# Altium schematic sheet Sheet1.SchDoc
size A4; SheetNumber: 1; SheetTotal: 1
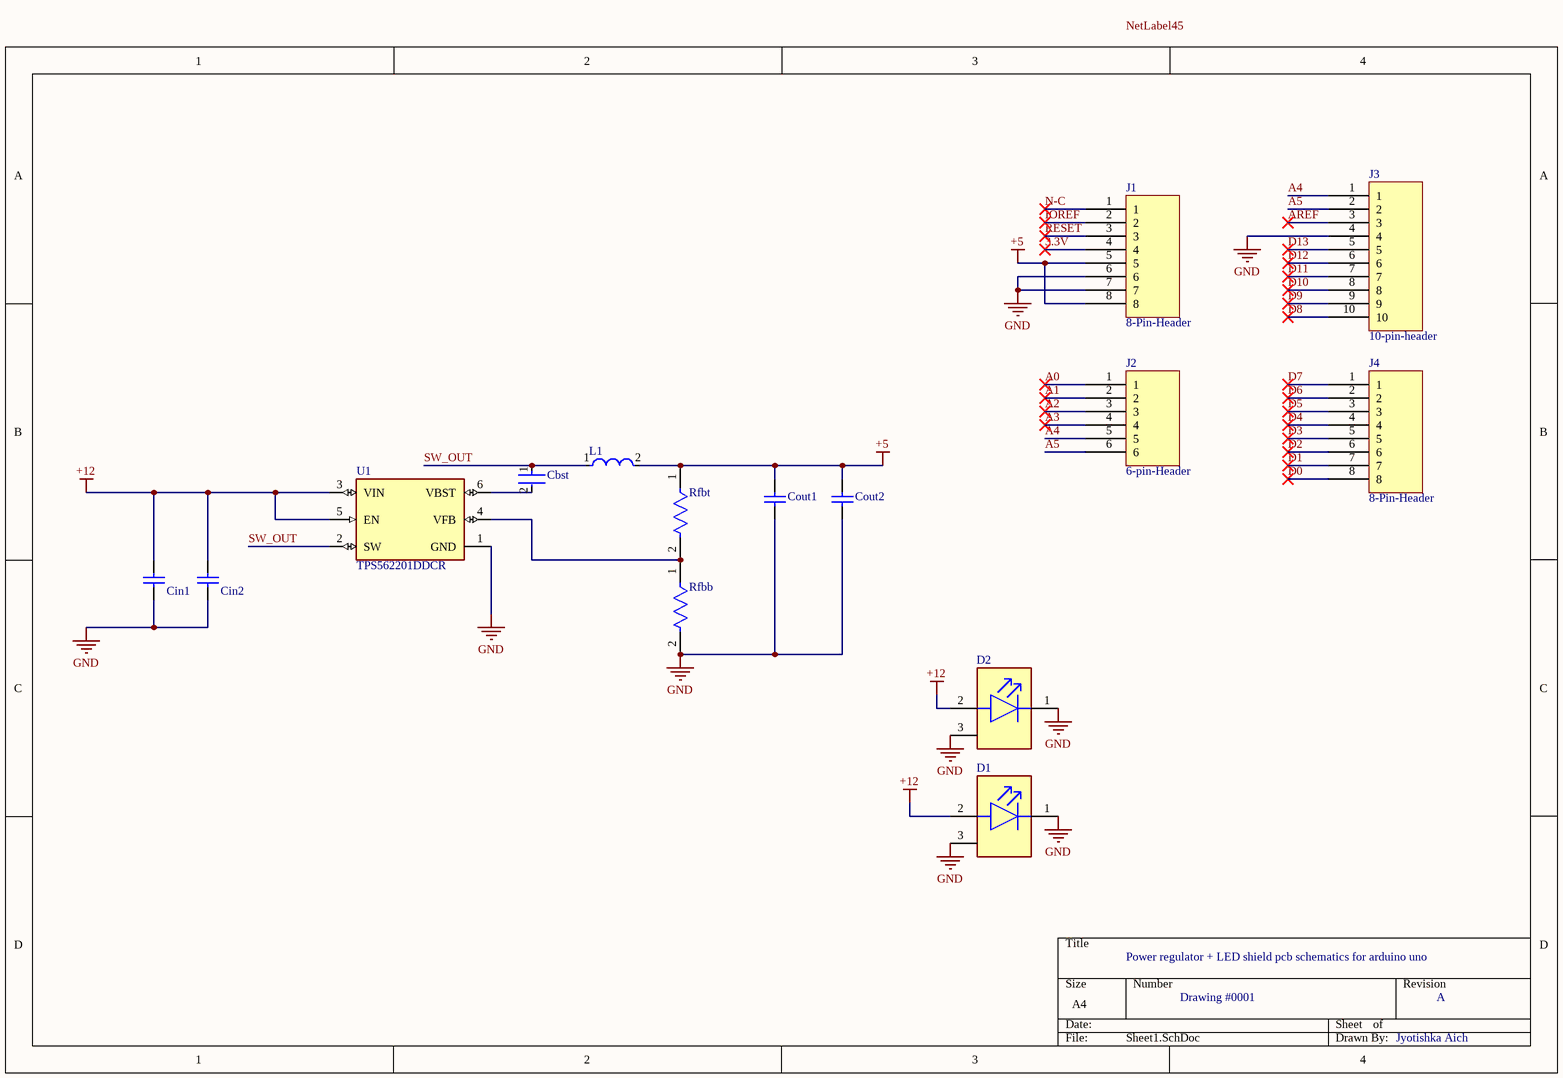
[diagram p0: Sheet1.SchDoc]

## Parts
Cbst  CC0805KRX7R8BB104  [FP-CC0805-0_85-MFG]  (value not drawn)
Cin1  GRM31CR61E106KA12L  [CAPC3216X180X55ML20T25]  (value not drawn)
Cin2  GRM31CR61E106KA12L  [CAPC3216X180X55ML20T25]  (value not drawn)
Cout1  C1608X5R1A226M080AC  [CAPC1608X100X20ML10]  (value not drawn)
Cout2  C1608X5R1A226M080AC  [CAPC1608X100X20ML10]  (value not drawn)
D1  LXR7-SW30  [FP-LXR7-SW30-MFG]  (value not drawn)
D2  LXR7-SW30  [FP-LXR7-SW30-MFG]  (value not drawn)
J1  8-Pin-Header  [8-Pin-Header-Footprint-1]
J2  6-pin-Header  [6-pin-Header-Footprint]
J3  10-pin-header  [10-pin-header-Footprint-1]
J4  8-Pin-Header  [8-Pin-Header-Footprint-1]
L1  NRS8030T3R3MJGJ  [FP-NRS8030-MFG]  (value not drawn)
Rfbb  CRCW040210K0FKED  [FP-CRCW0402-e3-IPC_B]  (value not drawn)
Rfbt  AC0402FR-0756K2L  [FP-AC0402-IPC_B]  (value not drawn)
U1  TPS562201DDCR  [FP-DDC0006A-IPC_C]

## Nets
+5: Cout1.1 Cout2.1 J1.5 J1.8 L1.2 Rfbt.1
+12: Cin1.1 Cin2.1 D1.2(A) D2.2(A) U1.3(VIN) U1.5(EN)
GND: Cin1.2 Cin2.2 Cout1.2 Cout2.2 D1.1(C) D1.3(THERMAL_PAD) D2.1(C) D2.3(THERMAL_PAD) J1.6 J1.7 J3.4 Rfbb.2 U1.1(GND)
3.3V: J1.4
A0: J2.1
A1: J2.2
A2: J2.3
A3: J2.4
A4: J2.5 J3.1
A5: J2.6 J3.2
AREF: J3.3
D0: J4.8
D1: J4.7
D2: J4.6
D3: J4.5
D4: J4.4
D5: J4.3
D6: J4.2
D7: J4.1
D8: J3.10
D9: J3.9
D10: J3.8
D11: J3.7
D12: J3.6
D13: J3.5
IOREF: J1.2
N-C: J1.1
RESET: J1.3
SW_OUT: Cbst.1 L1.1 U1.2(SW)
NetCbst_2: Cbst.2 U1.6(VBST)
NetRfbb_1: Rfbb.1 Rfbt.2 U1.4(VFB)

## Notes on the sheet
- Power regulator + LED shield pcb schematics for arduino uno
- Drawing #0001
- A
- Jyotishka Aich
- Labels drawn without touching a wire or pin: NetLabel45

## Library data of the parts
Cbst = CMP-1036-04410-2: CAP CER 0.1UF 25V X7R 0805; Manufacturer: Yageo; Tolerance: 0.1; Value: 100 nF; ComponentLink2URL: http://www.yageo.com/documents/recent/UPY-GPHC_Y5V_6.3V-to-50V_8.pdf; Category: Cap; Mouser Description: Multilayer Ceramic Capacitors MLCC - SMD/SMT 100nF 25V X7R 10%; Manufacturer Part Number: CC0805KRX7R8BB104; Device Class L1: Passive Components; Footprint Url: http://www.yageo.com/exep/pages/download/literatures/UPY-C_GEN_24.pdf; Height: 0.95mm; Material: Ceramic; Digikey Description: CAP CER 0.1UF 25V X7R 0805; Lead Free: Yes; Temperature Range High: +85°C; Temperature: -30°C to +85°C; Ipc Land Pattern Name: CAPC200125X85; Capacitance: 100 nF; Automotive: No; Octopart: https://octopart.com/cc0805krx7r8bb104-yageo-39467766; Device Class L2: Capacitors; Temperature Characteristic: X7R; Voltage Rating: 25 V; ComponentLink2Description: Datasheet; Temperature Range Low: -30°C; Device Class L3: Ceramic Capacitors; RoHS: TRUE; Package: CC0805-0.85
Cin1 Cin2 = CMP-2000-04947-1: Chip Capacitor, 10 uF, +/- 10%, 25 V, -55 to 85 degC, 1206 (3216 Metric), RoHS, Tape and Reel; Manufacturer: Murata; Case Height: 1.6mm; Voltage Rating DC: 25V; Capacitance: 10uF; Dielectric: X5R; Case Length: 3.2mm; Brand: MurataElectronics; Maximum Operating Temperature: +85C; Datasheet URL: https://datasheet.ciiva.com/11786/0900766b80ef921d-11786983.pdf; Tolerance: 10%; Case Code - mm: 3216; Datasheet Version: Sep-13; Packaging: Reel; Product Category: MultilayerCeramicCapacitorsMLCC-SMD/SMT; Manufacturer URL: http://www.murata.com/; Factory Pack Quantity: 2000; Type: GeneralPurposeMLCC; Minimum Operating Temperature: -55C; Product: GeneralTypeMLCCs; Package Reference: 1206; RoHS: Details; Package / Case: 1206(3216metric); Package Description: 2-Pin Surface Mount Device, Body 3.2 x 1.6 mm; Case Code - in: 1206; Termination Style: SMD/SMT; Series: GRM; Case Width: 1.6mm
Cout1 Cout2 = CMP-2000-05441-1: Chip Capacitor, 22 uF, +/- 20%, 10 V, -55 to 85 degC, 0603 (1608 Metric), RoHS, Tape and Reel; Manufacturer: TDK; PCN Part Number: MLCCPartNumberChange30/Nov/2012; Voltage - Rated: 10V; Product Training Modules: CSeriesGeneralApplicationsSEAT,CCV,andTVCLDesignToolsGuidetoReplacinganElectrolyticCapacitorwithanMLCC; Other Names: 445-9077-1; Design Resources: 20WNon-IsolatedBuckLEDDriverUsingPLLNK460KG; Online Catalog: CSeries,GeneralPurpose; Capacitance: 22µF; Temperature Coefficient: X5R; Kits: 445-9014-KIT-ND-KITMLCC100PF-22UF060310-50V; Packaging: CutTape(CT); Standard Package: 1; Package / Case: 0603(1608Metric); Lead Style: -; Features: -; Ratings: -; Operating Temperature: -55degC~85degC; Applications: GeneralPurpose; Package Reference: 603; Datasheet URL: http://download.siliconexpert.com/pdfs/2015/4/21/15/54/45/779/tdk_/manual/37024850441143360mlcc_commercial_general_en.pdf; Datasheet Version: Mar-15; Mounting Type: SurfaceMount,MLCC; Lead Spacing: -; Size / Dimension: 0.063"Lx0.031"W(1.60mmx0.80mm); Height - Seated (Max): -; Package Description: 2-Pin Surface Mount Device, Body 1.6 x 0.8 mm; Manufacturer URL: http://www.tdk.com/; RoHS Information: RoHSCertificate-MLCC; Tolerance: ±20%; Series: C; Thickness (Max): 0.035"(0.90mm); Family: CeramicCapacitors; Category: Capacitors
D1 D2 = CMP-2100-00228-2: LED LUXEON WARM WHITE 3000K 2SMD; Manufacturer: Philips Lumileds; Luminous Flux: 1000lm; Led Orientation: Top View; Max Junction Temp: +135°C; Forward Current: 1200mA; Forward Voltage: 11.2V; Viewing Angle: 120°; RoHS: TRUE; Octopart: https://octopart.com/lxr7-sw30-philips+lumileds-23267781; Colour: White; Temperature: -40°C to +135°C; Lead Free: Yes; Package: LXR7-SW30; Automotive: No; Digikey Description: LED LUXEON WARM WHITE 3000K 2SMD; Category: Diode; Manufacturer Part Number: LXR7-SW30; ComponentLink2URL: https://www.lumileds.com/uploads/354/DS103-pdf; Device Class L3: unset; Height: 3.87mm; Mouser Description: High Power LEDs - White Warm White, 3000K 840lm, 700mA, 70CRI; Device Class L1: Optoelectronics; Device Class L2: LEDs; ComponentLink2Description: Datasheet; Temperature Range Low: -40°C; Temperature Range High: +135°C
J1 J4 = CMP-002-00072-5
J2 = CMP-002-00071-7
J3 = CMP-002-00073-5
L1 = CMP-14484-000405-1: Inductor Power Shielded Wirewound 3.3uH 20% 100KHz Ferrite 4.2A 24.7mΩ DCR T/R; Current Rating: 4.3A; DC Resistance (DCR): 19mR; Self Resonant Frequency: 50MHz; Height: 3mm; Lead Free: Lead Free; Saturation Current: 4.2A; Termination: SMD/SMT; RoHS Compliant: Yes; Resistor Type: Wirewound; RMS Current (Irms): 4.3A; Series: NRS; Halogen Free: Halogen Free; Shielding: Shielded; Length: 8mm; Max DC Current: 4.2A; Height - Seated (Max): 0.118inch; Radiation Hardening: No; Min Operating Temperature: -25°C; Number of Pins: 2; Core Material: Ferrite; Inductance: 3.3uH; Package Quantity: 1000; REACH SVHC: No SVHC; Test Frequency: 100kHz; Tolerance: 20%; Case/Package: Nonstandard; Inductance Tolerance: 20%; Width: 0.315inch; Mount: Surface Mount; Depth: 8.2mm; Lead Pitch: 5.6mm; Packaging: Tape and Reel; Max Operating Temperature: 125°C
Rfbb = CMP-2002-08135-2: RES SMD 10K OHM 1% 1/16W 0402; Power Rating: 63mW; Resistance: 10kR; Voltage Rating: 50V; Temperature Coefficient: 100ppm/°C; Case Code (Metric): 1005; Features: Automotive AEC-Q200; Termination: SMD/SMT; Mount: Surface Mount; Package Quantity: 10; Packaging: Tape and Reel; Case Code (Imperial): 0402; Weight: 2.3E-05oz; Lead Free: Lead Free; Width: 0.02inch; Max Power Dissipation: 63mW; Tolerance: 1%; Number of Terminations: 2; Height: 0.35mm; Number of Pins: 2; Composition: Thick Film; Length: 1mm; Voltage Rating (DC): 50V; Case/Package: 0402; Radiation Hardening: No; Contact Plating: Tin; Depth: 0.5mm; Military Standard: Not; Min Operating Temperature: -55°C; Max Operating Temperature: 155°C
Rfbt = CMP-03412-003341-2: RES 56.2kΩ ±1% 0.063W 0402; Resistance: 56.2kR; Temperature Coefficient: 100ppm/°C; Max Power Dissipation: 63mW; Series: AC; Tolerance: 1%; Case/Package: 0402; RoHS Compliant: Yes; Resistor Type: Thick Film; Min Operating Temperature: -55°C; Length: 0.039inch; Max Operating Temperature: 155°C; Features: Moisture Resistant; Packaging: Tape and Reel; Number of Terminations: 2; Width: 0.02inch; Height: 0.015inch
U1 = CMP-019-00049-1: Switching Regulator, 2A, 580kHz Switching Freq-Max, PDSO6; Channels: 1; Min Input Voltage: 4.5V; Nominal Supply Voltage: 12V; Package Body Material: Plastic; Max Supply Voltage: 17V; Control Technique: PULSE WIDTH MODULATION; Switcher Configuration: BUCK; Throw Configuration: SWITCHING REGULATOR; Temperature Grade: AUTOMOTIVE; Reach SVHC Compliant: Yes; Case/Package: TSSOP; Terminal Position: DUAL; Max Operating Temperature: 125°C; Terminal Form: Gull Wing; JESD-609 Code: e3; Package Shape: Rectangular; Frequency: 580kHz; Length: 2.9mm; Terminal Pitch: 0.95mm; Pins: 6; Height - Seated (Max): 1.1mm; Surface Mount: Yes; Package Style: SMALL OUTLINE, THIN PROFILE, SHRINK PITCHMeter; RoHS Compliant: Yes; JESD-30 Code: R-PDSO-G6; Width: 1.6mm; Terminal Finish: Tin; Min Operating Temperature: -40°C; Moisture Sensitivity Level: 1